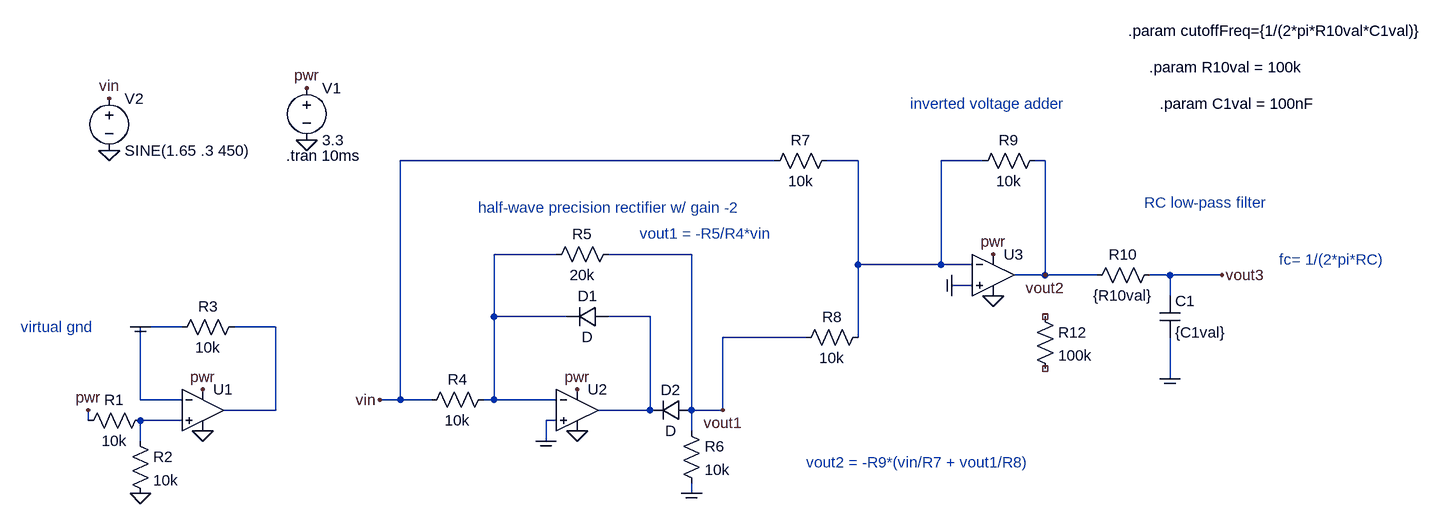
[diagram p0: schematic emg circuit diagram.asc]
emg circuit diagram.asc, the LTspice schematic file:
Version 4.1
SHEET 1 2408 680
WIRE 1328 -240 752 -240
WIRE 1456 -240 1408 -240
WIRE 1648 -240 1584 -240
WIRE 1744 -240 1728 -240
WIRE 992 -96 896 -96
WIRE 1200 -96 1072 -96
WIRE 1456 -80 1456 -240
WIRE 1584 -80 1584 -240
WIRE 1584 -80 1456 -80
WIRE 1632 -80 1584 -80
WIRE 1744 -64 1744 -240
WIRE 1744 -64 1696 -64
WIRE 1824 -64 1744 -64
WIRE 1936 -64 1904 -64
WIRE 2016 -64 1936 -64
WIRE 1632 -48 1600 -48
WIRE 1936 -32 1936 -64
WIRE 896 0 896 -96
WIRE 1008 0 896 0
WIRE 1136 0 1072 0
WIRE 416 16 352 16
WIRE 560 16 496 16
WIRE 1376 32 1248 32
WIRE 1456 32 1456 -80
WIRE 1936 96 1936 32
WIRE 352 128 352 16
WIRE 416 128 352 128
WIRE 752 128 752 -240
WIRE 752 128 720 128
WIRE 800 128 752 128
WIRE 896 128 896 0
WIRE 896 128 880 128
WIRE 992 128 896 128
WIRE 560 144 560 16
WIRE 560 144 480 144
WIRE 1136 144 1136 0
WIRE 1136 144 1056 144
WIRE 1200 144 1200 -96
WIRE 1248 144 1248 32
WIRE 1248 144 1200 144
WIRE 272 160 272 144
WIRE 416 160 352 160
WIRE 992 160 976 160
WIRE 1200 176 1200 144
WIRE 352 192 352 160
WIRE 976 192 976 160
WIRE 1200 272 1200 256
FLAG 608 -352 pwr
FLAG 608 -272 0
FLAG 272 144 pwr
FLAG 352 272 0
FLAG 448 112 pwr
FLAG 448 176 0
FLAG 352 16 COM
FLAG 720 128 vin
FLAG 976 192 COM
FLAG 1024 112 pwr
FLAG 1024 176 0
FLAG 1248 144 vout1
FLAG 1200 272 COM
FLAG 1664 -32 0
FLAG 1664 -96 pwr
FLAG 1600 -48 COM
FLAG 1744 -64 vout2
FLAG 1936 96 COM
FLAG 2016 -64 vout3
FLAG 304 -256 0
FLAG 304 -336 vin
DATAFLAG 352 48 ""
SYMBOL voltage 608 -368 R0
WINDOW 123 0 0 Left 0
WINDOW 39 0 0 Left 0
SYMATTR InstName V1
SYMATTR Value 3.3
SYMBOL res 368 144 R90
WINDOW 0 0 56 VBottom 2
WINDOW 3 32 56 VTop 2
SYMATTR InstName R1
SYMATTR Value 10k
SYMBOL res 336 176 R0
SYMATTR InstName R2
SYMATTR Value 10k
SYMBOL OpAmps\\UniversalOpAmp2 448 144 R0
SYMATTR InstName U1
SYMBOL res 512 0 R90
WINDOW 0 0 56 VBottom 2
WINDOW 3 32 56 VTop 2
SYMATTR InstName R3
SYMATTR Value 10k
SYMBOL res 896 112 R90
WINDOW 0 0 56 VBottom 2
WINDOW 3 32 56 VTop 2
SYMATTR InstName R4
SYMATTR Value 10k
SYMBOL OpAmps\\UniversalOpAmp2 1024 144 R0
SYMATTR InstName U2
SYMBOL diode 1072 -16 R90
WINDOW 0 0 32 VBottom 2
WINDOW 3 32 32 VTop 2
SYMATTR InstName D1
SYMBOL res 1088 -112 R90
WINDOW 0 0 56 VBottom 2
WINDOW 3 32 56 VTop 2
SYMATTR InstName R5
SYMATTR Value 20k
SYMBOL diode 1200 128 R90
WINDOW 0 0 32 VBottom 2
WINDOW 3 32 32 VTop 2
SYMATTR InstName D2
SYMBOL res 1184 160 R0
SYMATTR InstName R6
SYMATTR Value 10k
SYMBOL res 1424 -256 R90
WINDOW 0 0 56 VBottom 2
WINDOW 3 32 56 VTop 2
SYMATTR InstName R7
SYMATTR Value 10k
SYMBOL res 1472 16 R90
WINDOW 0 0 56 VBottom 2
WINDOW 3 32 56 VTop 2
SYMATTR InstName R8
SYMATTR Value 10k
SYMBOL OpAmps\\UniversalOpAmp2 1664 -64 R0
SYMATTR InstName U3
SYMBOL res 1744 -256 R90
WINDOW 0 0 56 VBottom 2
WINDOW 3 32 56 VTop 2
SYMATTR InstName R9
SYMATTR Value 10k
SYMBOL res 1920 -80 R90
WINDOW 0 0 56 VBottom 2
WINDOW 3 32 56 VTop 2
SYMATTR InstName R10
SYMATTR Value {R10val}
SYMBOL cap 1920 -32 R0
SYMATTR InstName C1
SYMATTR Value {C1val}
SYMBOL voltage 304 -352 R0
WINDOW 123 0 0 Left 0
WINDOW 39 0 0 Left 0
SYMATTR InstName V2
SYMATTR Value SINE(1.65 .3 450)
SYMBOL res 1728 -16 R0
SYMATTR InstName R12
SYMATTR Value 100k
TEXT 576 -248 Left 2 !.tran 10ms
TEXT 168 16 Left 2 ;virtual gnd
TEXT 1120 -128 Left 2 ;vout1 = -R5/R4*vin
TEXT 872 -168 Left 2 ;half-wave precision rectifier w/ gain -2
TEXT 1536 -328 Left 2 ;inverted voltage adder
TEXT 1896 -176 Left 2 ;RC low-pass filter
TEXT 1904 -384 Left 2 !.param R10val = 100k
TEXT 1920 -328 Left 2 !.param C1val = 100nF
TEXT 1872 -440 Left 2 !.param cutoffFreq={1/(2*pi*R10val*C1val)}
TEXT 1376 224 Left 2 ;vout2 = -R9*(vin/R7 + vout1/R8)
TEXT 2104 -88 Left 2 ;fc= 1/(2*pi*RC)

The netlist it stands for:
* emg circuit diagram.asc
V1 pwr 0 3.3
R1 N005 pwr 10k
R2 N005 0 10k
X§U1 N005 COM pwr 0 N004 level2 Avol=1Meg GBW=10Meg Slew=10Meg Ilimit=25m Rail=0 Vos=0 En=0 Enk=0 In=0 Ink=0 Rin=500Meg  ; pins In+ In- V+ V- OUT
R3 N004 COM 10k
R4 N002 vin 10k
X§U2 COM N002 pwr 0 N003 level2 Avol=1Meg GBW=10Meg Slew=10Meg Ilimit=25m Rail=0 Vos=0 En=0 Enk=0 In=0 Ink=0 Rin=500Meg  ; pins In+ In- V+ V- OUT
D1 N003 N002 D
R5 vout1 N002 20k
D2 vout1 N003 D
R6 vout1 COM 10k
R7 N001 vin 10k
R8 N001 vout1 10k
X§U3 COM N001 pwr 0 vout2 level2 Avol=1Meg GBW=10Meg Slew=10Meg Ilimit=25m Rail=0 Vos=0 En=0 Enk=0 In=0 Ink=0 Rin=500Meg  ; pins In+ In- V+ V- OUT
R9 vout2 N001 10k
R10 vout3 vout2 {R10val}
C1 vout3 COM {C1val}
V2 vin 0 SINE(1.65 .3 450)
R12 NC_01 NC_02 100k
.model D D
.lib standard.dio
.tran 10ms
* virtual gnd
* vout1 = -R5/R4*vin
* half-wave precision rectifier w/ gain -2
* inverted voltage adder
* RC low-pass filter
.param R10val = 100k
.param C1val = 100nF
.param cutoffFreq={1/(2*pi*R10val*C1val)}
* vout2 = -R9*(vin/R7 + vout1/R8)
* fc= 1/(2*pi*RC)
.lib UniversalOpAmp2.lib
.backanno
.end